# EAGLE design main (EAGLE 9.2.2)
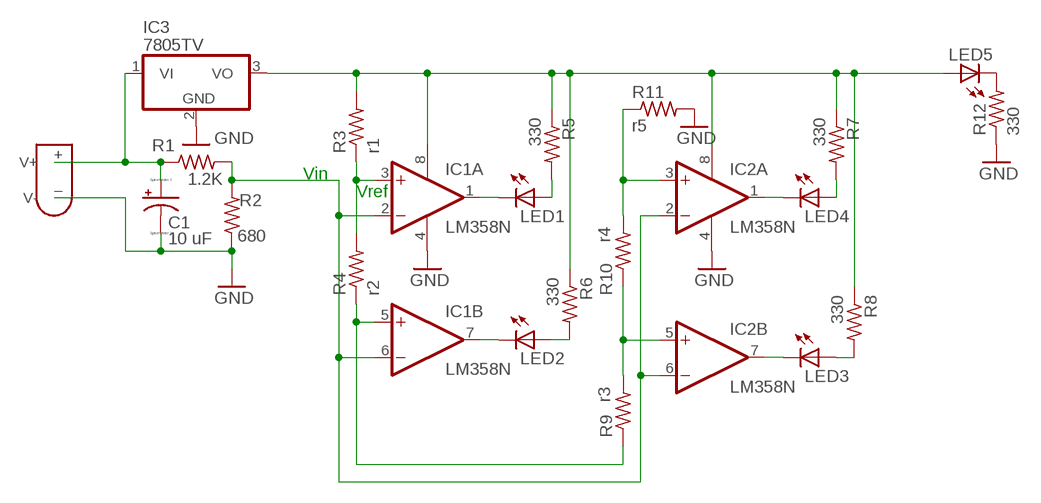
[diagram p0: schematic, sheet 1]

## Parts
C1  10 uF  CPOL-USE2-5  [E2-5]
IC1  LM358N  [DIL08]
IC2  LM358N  [DIL08]
IC3  7805TV  [TO220V]
LED1  LED5MM  [LED5MM]
LED2  LED5MM  [LED5MM]
LED3  LED5MM  [LED5MM]
LED4  LED5MM  [LED5MM]
LED5  LED5MM  [LED5MM]
R1  1.2K  R-US_0207/7  [0207/7]
R2  680  R-US_0207/7  [0207/7]
R3  r1  R-US_0207/7  [0207/7]
R4  r2  R-US_0207/7  [0207/7]
R5  330  R-US_0207/7  [0207/7]
R6  330  R-US_0207/7  [0207/7]
R7  330  R-US_0207/7  [0207/7]
R8  330  R-US_0207/7  [0207/7]
R9  r3  R-US_0207/7  [0207/7]
R10  r4  R-US_0207/7  [0207/7]
R11  r5  R-US_0207/7  [0207/7]
R12  330  R-US_0207/7  [0207/7]
U$1  XT30  [XT30]

## Nets
GND: C1.- IC1.4(P:V-) IC2.4(P:V-) IC3.2(GND) R2.1 R11.2 R12.1 U$1.–(V-)
N$1: IC1.3(A:+IN) R3.1 R4.2
N$2: C1.+ IC3.1(VI) R1.1 U$1.+(V+)
N$3: IC1.8(P:V+) IC2.8(P:V+) IC3.3(VO) LED5.A R3.2 R5.1 R6.1 R7.1 R8.1
N$4: IC1.5(B:+IN) R4.1 R9.1
N$5: IC1.1(A:OUT) LED1.K(C)
N$6: LED1.A R5.2
N$7: LED2.A R6.2
N$8: IC1.7(B:OUT) LED2.K(C)
N$9: IC2.1(A:OUT) LED4.K(C)
N$10: LED4.A R7.2
N$11: IC2.7(B:OUT) LED3.K(C)
N$12: LED3.A R8.2
N$13: IC1.2(A:-IN) IC1.6(B:-IN) IC2.2(A:-IN) IC2.6(B:-IN) R1.2 R2.2
N$14: IC2.5(B:+IN) R9.2 R10.1
N$15: IC2.3(A:+IN) R10.2 R11.1
N$16: LED5.K(C) R12.2

## Notes on the sheet
- Vin
- Vref

## Library data of the parts
C1 = resistor:CPOL-US: POLARIZED CAPACITOR, American symbol
IC1 IC2 = linear:LM358: OP AMP also LM158; LM258; LM2904 Source: http://cache.national.com/ds/LM/LM158.pdf
IC3 = linear:78*: Positive VOLTAGE REGULATOR Source: http://cache.national.com/ds/LM/LM78L05.pdf http://www.fairchildsemi.com/ds/LM/LM7805.pdf; SPICEPREFIX: U
LED1-LED5 = led:LED: LED OSRAM: - CHIPLED LG R971, LG N971, LY N971, LG Q971, LY Q971, LO R971, LY R971 LH N974, LH R974 LS Q976, LO Q976, LY Q976 LO Q996 - Hyper CHIPLED LW Q18S LB Q993, LB Q99A, LB R99A - SideLED LS A670, LO A670, LY A670, LG A670, LP A670 LB A673, LV A673, LT A673, LW A673 LH A674 LY A675 LS A676, LA A676, LO A676, LY A676, LW A676 LS A679, LY A679, LG A679 - Hyper Micro SIDELED® LS Y876, LA Y876, LO Y876, LY Y876 LT Y87S - SmartLED LW L88C, LW L88S LB L89C, LB L89S, LG L890 LS L89K, LO L89K, LY L89K LS L896, LA L896, LO L896, LY L896 - TOPLED LS T670, LO T670, LY T670, LG T670, LP T670 LSG T670, LSP T670, LSY T670, LOP T670, LYG T670 LG T671, LOG T671, LSG T671 LB T673, LV T673, LT T673, LW T673 LH T674 LS T676, LA T676, LO T676, LY T676, LB T676, LH T676, LSB T676, LW T676 LB T67C, LV T67C, LT T67C, LS T67K, LO T67K, LY T67K, LW E67C LS E67B, LA E67B, LO E67B, LY E67B, LB E67C, LV E67C, LT E67C LW T67C LS T679, LY T679, LG T679 LS T770, LO T770, LY T770, LG T770, LP T770 LB T773, LV T773, LT T773, LW T773 LH T774 LS E675, LA E675, LY E675, LS T675 LS T776, LA T776, LO T776, LY T776, LB T776 LHGB T686 LT T68C, LB T68C - Hyper Mini TOPLED® LB M676 - Mini TOPLED Santana® LG M470 LS M47K, LO M47K, LY M47K Source: http://www.osram.convergy.de LUXEON: - LUMILED® LXK2-PW12-R00, LXK2-PW12-S00, LXK2-PW14-U00, LXK2-PW14-V00 LXK2-PM12-R00, LXK2-PM12-S00, LXK2-PM14-U00 LXK2-PE12-Q00, LXK2-PE12-R00, LXK2-PE12-S00, LXK2-PE14-T00, LXK2-PE14-U00 LXK2-PB12-K00, LXK2-PB12-L00, LXK2-PB12-M00, LXK2-PB14-N00, LXK2-PB14-P00, LXK2-PB14-Q00 LXK2-PR12-L00, LXK2-PR12-M00, LXK2-PR14-Q00, LXK2-PR14-R00 LXK2-PD12-Q00, LXK2-PD12-R00, LXK2-PD12-S00 LXK2-PH12-R00, LXK2-PH12-S00 LXK2-PL12-P00, LXK2-PL12-Q00, LXK2-PL12-R00 Source: www.luxeon.com KINGBRIGHT: KA-3528ASYC Source: www.kingbright.com
R1-R12 = resistor:R-US_: RESISTOR, American symbol
U$1 = random:XT30: XT30 connector

## Board
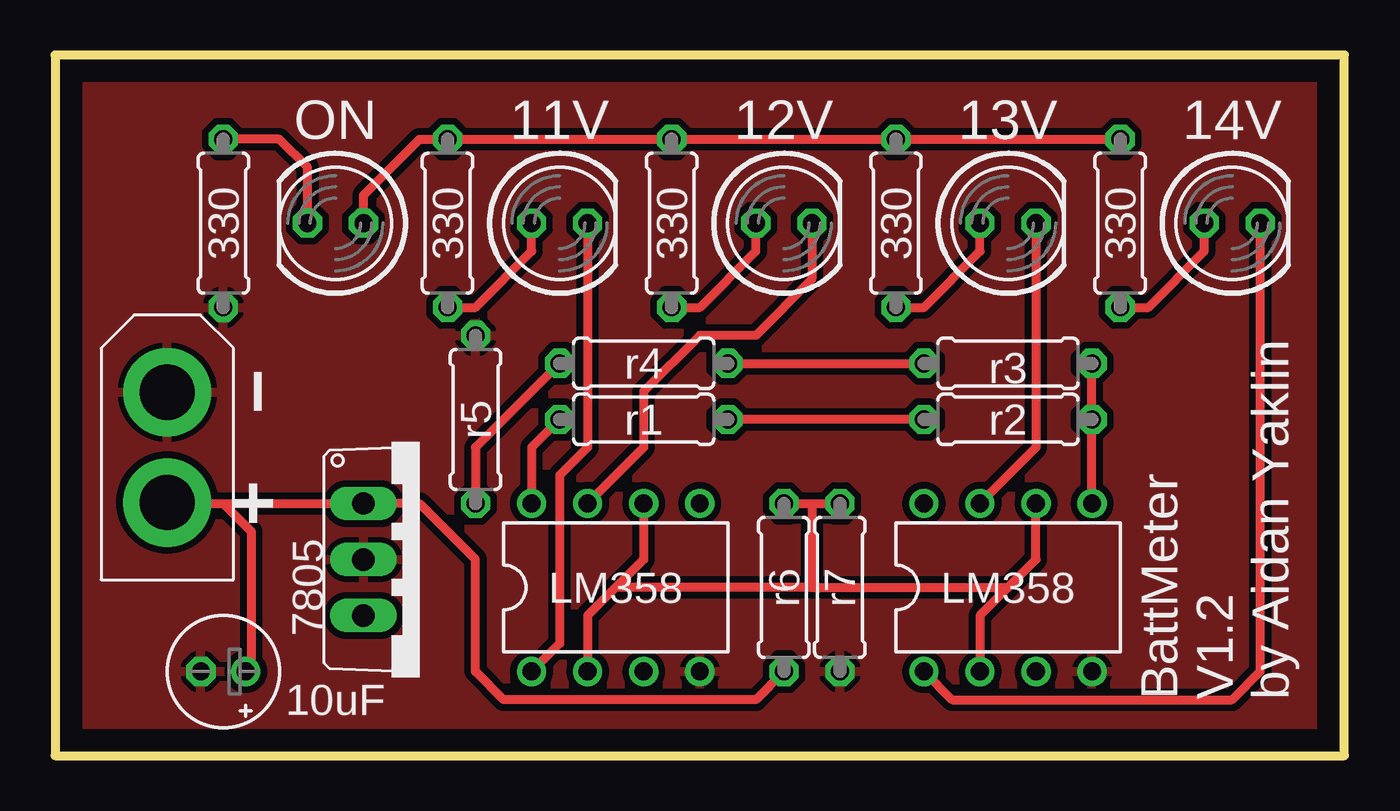
[diagram p1: board, top side]
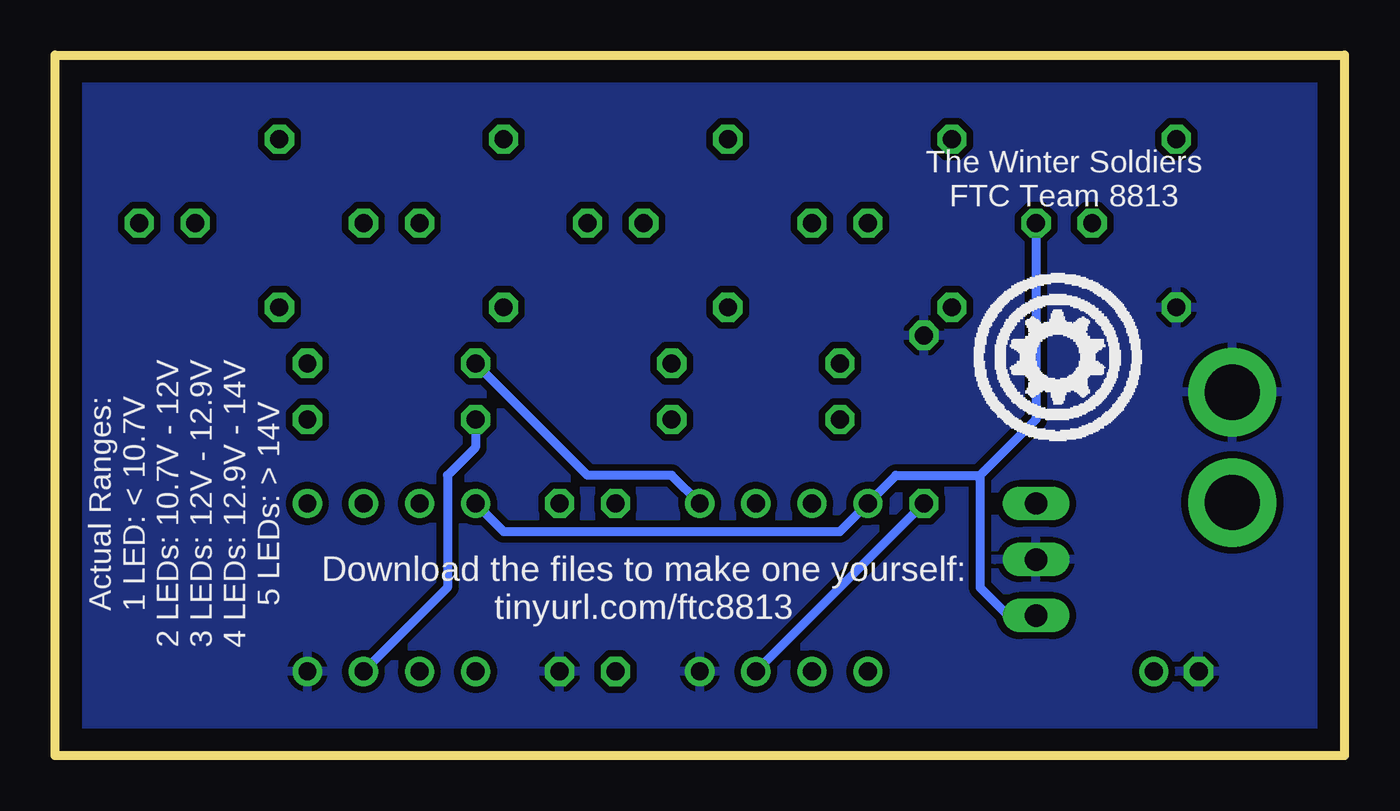
[diagram p2: board, bottom side, seen from below]

Size 58.42 x 31.75 mm. Coordinates in mm from the lower left corner, seen from the top.
Outline: 58.42,0 58.42,31.75 0,31.75 0,0 58.42,0
Copper layers (1*16): Top 0.035mm / dielectric 1.5mm / Bottom 0.035mm
Design rules "default": minimum track width 6mil, minimum drill 0.35mm, track to track 6mil, track to pad 6mil, pad to pad 6mil, via to via 6mil, smd to smd 6mil, copper to edge 40mil, drill to drill 6mil, minimum pad ring 10mil, minimum via ring 8mil, stop-mask expansion 4mil, vias tented up to drill 0mil, thermal gap 10mil

### Footprints (pad centres in the part's own frame; a part is rotated, then mirrored left to right if it is on the bottom)
E2-5 = drill 0.813 pad 1.27: + -1.016,0 | drill 0.813 pad 1.27 octagon: - 1.016,0
DIL08 = drill 0.813 pad 1.27: 1 -3.81,-3.81; 2 -1.27,-3.81; 3 1.27,-3.81; 4 3.81,-3.81; 5 3.81,3.81; 6 1.27,3.81; 7 -1.27,3.81; 8 -3.81,3.81
TO220V = drill 1.016 long: 1 -2.54,-2.54; 2 0,-2.54; 3 2.54,-2.54
LED5MM = drill 0.813 octagon: A -1.27,0; K 1.27,0
0207/7 = drill 0.813 octagon: 1 -3.81,0; 2 3.81,0
XT30 = drill 2.5 pad 4: + 2.5,0; – -2.5,0

### Placement (x,y rotation side)
C1  7.62,3.81 180 top
IC1  43.18,7.62 0 top
IC2  25.4,7.62 0 top
IC3  16.51,8.89 270 top
LED1  53.34,24.13 0 top
LED2  43.18,24.13 0 top
LED3  33.02,24.13 0 top
LED4  22.86,24.13 0 top
LED5  12.7,24.13 180 top
R1  33.02,7.62 90 top
R2  35.56,7.62 90 top
R3  26.67,15.24 180 top
R4  43.18,15.24 180 top
R5  48.26,24.13 270 top
R6  38.1,24.13 270 top
R7  17.78,24.13 270 top
R8  27.94,24.13 270 top
R9  43.18,17.78 180 top
R10  26.67,17.78 180 top
R11  19.05,15.24 90 top
R12  7.62,24.13 90 top
U$1  5.08,13.97 270 top
U$2  [LOGO]  12.95,18.03 0 top

### Tracks (layer width: path | path; a pad name or v marks a point on that pad's centre or on a via)
GND
  pour Top (isolate 0.305): 0,31.75 0,0 58.42,0 58.42,31.75
  pour Bottom (isolate 0.305): -0.01,31.75 0,0 58.42,0 58.42,31.75
N$1
  Top 0.406: R4.2 R3.1
  Bottom 0.406: R4.2 39.37,13.97 40.64,12.7 40.64,7.62 IC1.3
N$2
  Top 0.406: R1.1 31.75,2.54 20.32,2.54 19.05,3.81 19.05,8.89 16.51,11.43 IC3.1 7.62,11.43 | C1.+ 8.89,3.81 8.89,10.16 7.62,11.43 | U$1.+ 5.08,11.43 7.62,11.43
N$3
  Top 0.406: LED5.A 13.97,25.4 16.51,27.94 R7.1 R8.1 R6.1 R5.1 | R3.2 21.59,13.97 IC2.8
  Bottom 0.406: IC1.8 38.1,10.16 22.86,10.16 IC2.8 20.32,12.7 16.51,12.7 | LED5.A 13.97,15.24 16.51,12.7 | 16.51,12.7 16.51,7.62 15.24,6.35 IC3.3
N$4
  Top 0.406: R9.1 R4.1 IC1.5
N$5
  Top 0.406: IC1.1 40.64,2.54 53.34,2.54 54.61,3.81 LED1.K
N$6
  Top 0.406: R5.2 49.53,20.32 52.07,22.86 LED1.A
N$7
  Top 0.406: R6.2 39.37,20.32 41.91,22.86 LED2.A
N$8
  Top 0.406: LED2.K 44.45,13.97 IC1.7
N$9
  Top 0.406: LED4.K 24.13,13.97 22.86,12.7 22.86,5.08 IC2.1
N$10
  Top 0.406: R7.2 19.05,20.32 21.59,22.86 LED4.A
N$11
  Top 0.406: LED3.K 34.29,21.59 31.75,19.05 29.21,19.05 26.67,16.51 26.67,13.97 IC2.7
N$12
  Top 0.406: R8.2 29.21,20.32 31.75,22.86 LED3.A
N$13
  Top 0.406: R1.2 34.29,11.43 | 34.29,11.43 R2.2 | 34.29,11.43 34.29,7.62 | IC2.6 26.67,8.89 25.4,7.62 | 25.4,7.62 24.13,6.35 IC2.2 | 34.29,7.62 25.4,7.62 | 34.29,7.62 43.18,7.62 | 43.18,7.62 44.45,8.89 IC1.6 | 43.18,7.62 41.91,6.35 IC1.2
N$14
  Top 0.406: R10.1 R9.2
  Bottom 0.406: R9.2 34.29,12.7 30.48,12.7 IC2.5
N$15
  Top 0.406: R10.2 19.05,13.97 R11.1
  Bottom 0.406: R11.1 IC2.3
N$16
  Top 0.406: LED5.K 11.43,26.67 10.16,27.94 R12.2

### Text on the board
tPlace: ON | 11V | 12V | 13V | 14V | 330 | 330 | 330 | 330 | 330 | r4 | – | r3 | r5 | r1 | r2 | + | 7805 | LM358 | r6 | r7 | LM358 | 10uF | BattMeter / V1.2 / by Aidan Yaklin
bPlace: The Winter Soldiers / FTC Team 8813 | Actual Ranges: / 1 LED: < 10.7V / 2 LEDs: 10.7V - 12V / 3 LEDs: 12V - 12.9V / 4 LEDs: 12.9V - 14V / 5 LEDs: > 14V | Download the files to make one yourself: / tinyurl.com/ftc8813